# EAGLE board invaders (EAGLE 9.5.1)
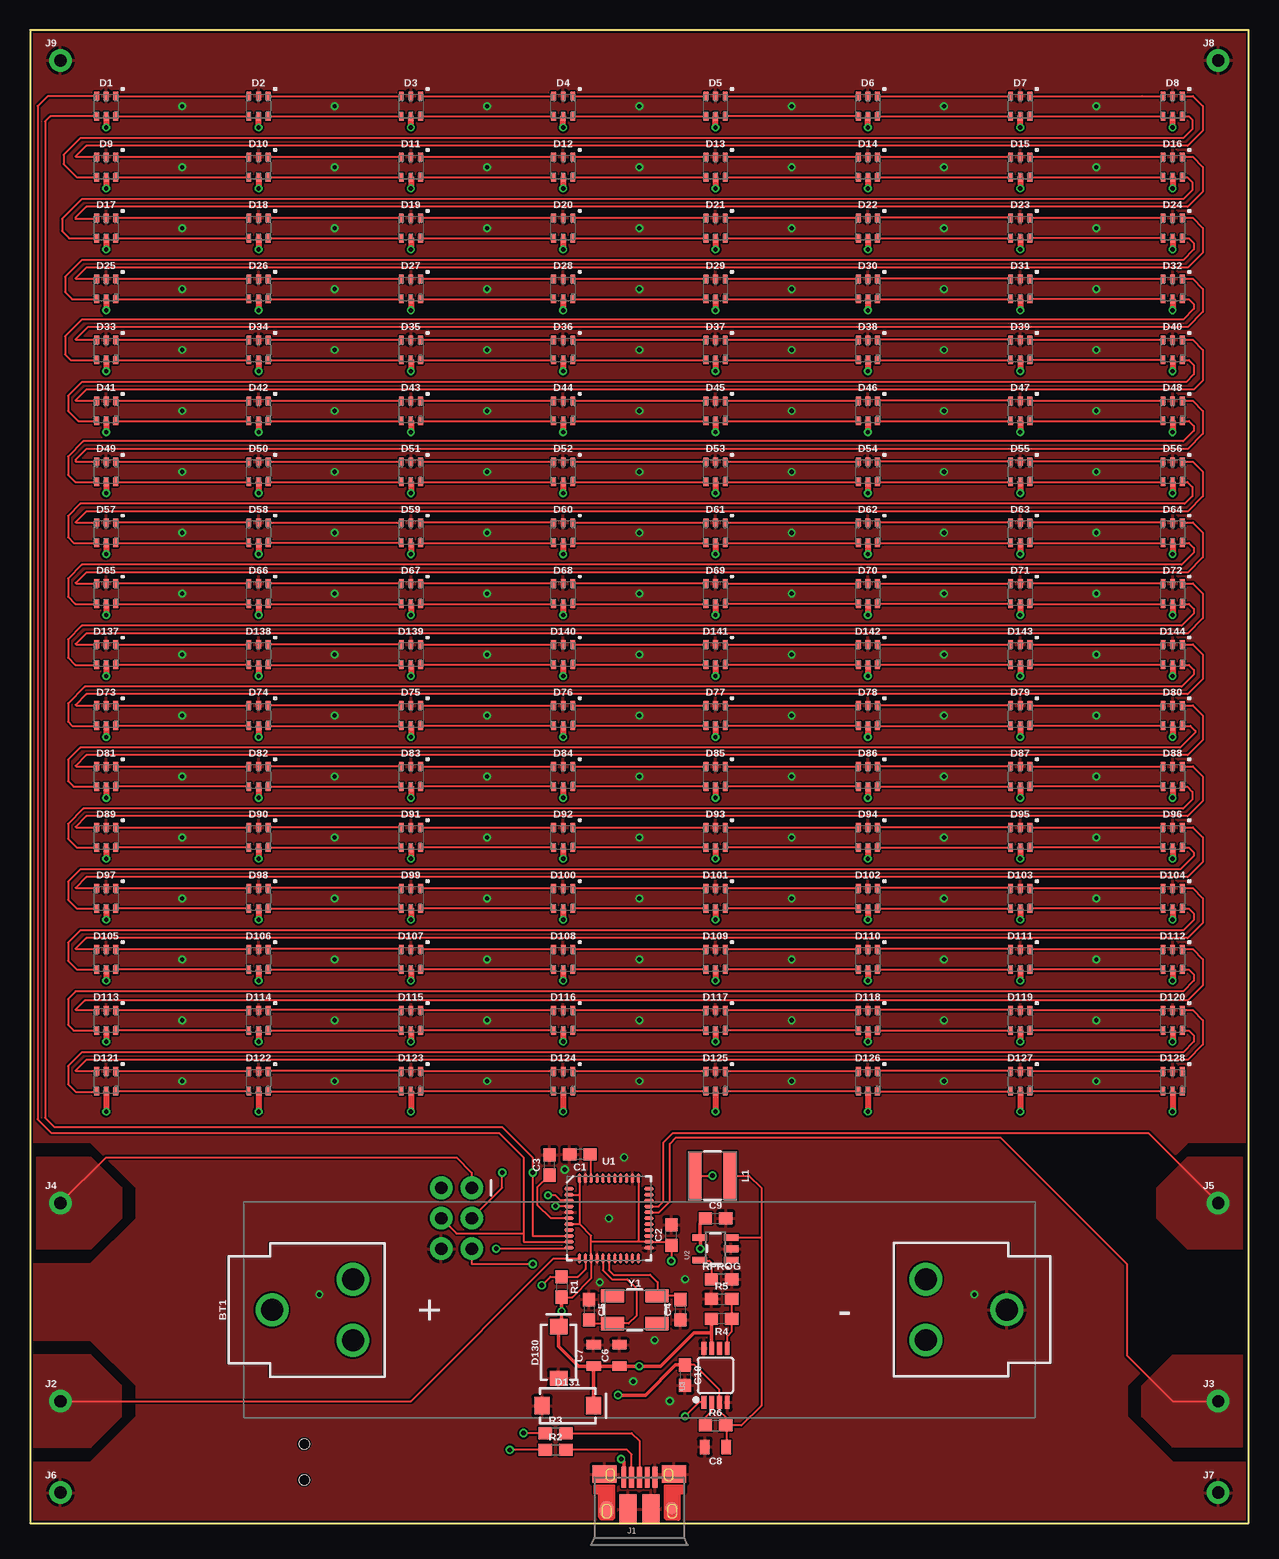
[diagram p2: board, top side]
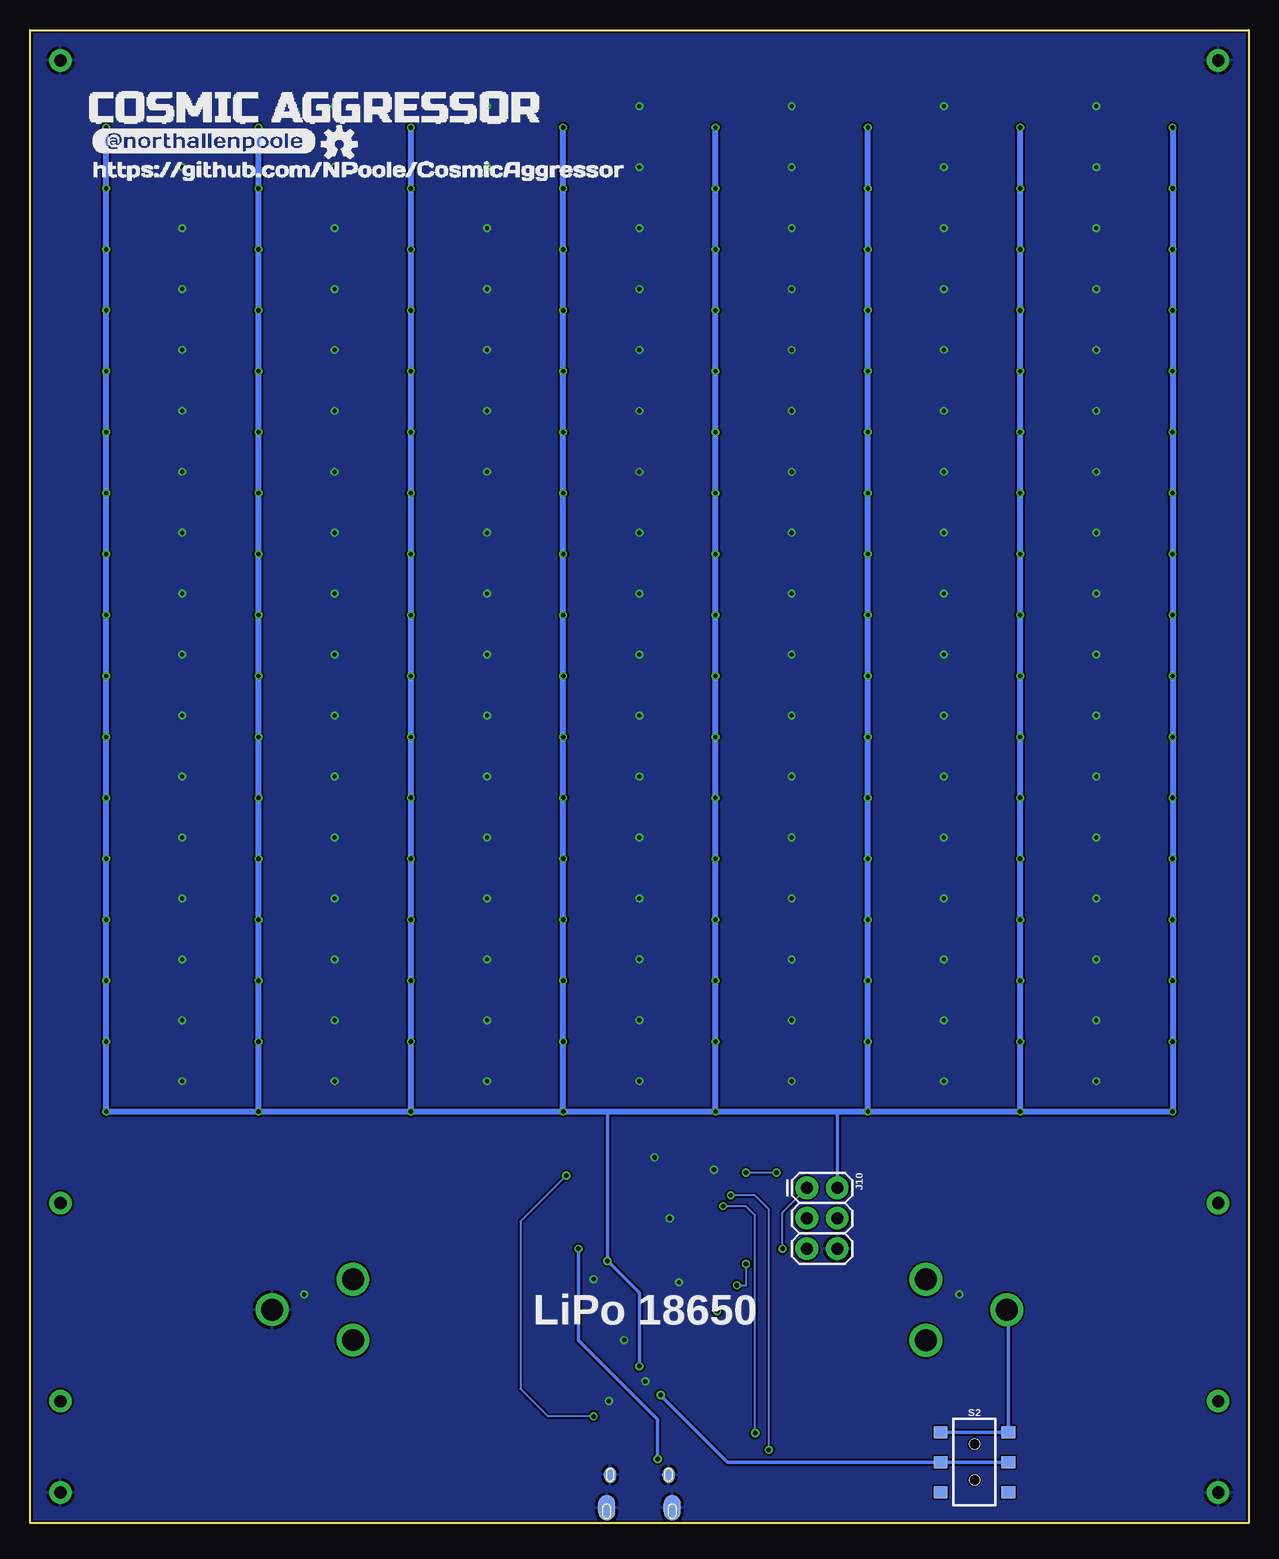
[diagram p3: board, bottom side, seen from below]

Size 101.6 x 124.46 mm. Coordinates in mm from the lower left corner, seen from the top.
Outline: 0,0 101.6,0 101.6,124.46 0,124.46 0,0
Copper layers (1*16): Top 0.035mm / dielectric 1.5mm / Bottom 0.035mm
Design rules "SparkFun-2-layer-PCBWay-LIMIT": minimum track width 6mil, minimum drill 0.3mm, track to track 6mil, track to pad 6mil, pad to pad 6mil, via to via 6mil, smd to smd 6mil, copper to edge 6mil, drill to drill 6mil, minimum pad ring 6mil, minimum via ring 6mil, stop-mask expansion 4mil, vias tented up to drill 25mil, thermal gap 10mil
Net classes: 0 default: width 0.152 mm, drill 0.305 mm, clearance 0.152 mm; 1 VCC: width 0.508 mm

## Footprints (pad centres in the part's own frame; a part is rotated, then mirrored left to right if it is on the bottom)
BATTERY_18650-HOLDER = drill 1.829: GND@1 30.628,0.01; GND@2 23.88,2.55; GND@3 23.88,-2.53; PWR@1 -30.628,-0.01; PWR@2 -23.88,2.53; PWR@3 -23.88,-2.55
0603 = smd 1.1 x 1: 1 -0.85,0; 2 0.85,0
0805 = smd 0.8 x 1.2: 1 -0.9,0; 2 0.9,0
APA102-2020 = smd 0.4 x 0.7: CKI -0.8,-0.85; CKO 0.8,-0.85; GND 0,0.85; SDI -0.8,0.85; SDO 0.8,0.85; VDD 0,-0.85
SMA-DIODE = smd 1.27 x 1.47: A -2.15,0; C 2.15,0
USB-MICROB-PTH-MILL = smd 0.4 x 1.75: D+ 0,0; D- -0.65,0; GND 1.3,0; ID 0.65,0; VBUS -1.3,0 | smd 2 x 1.46: SHIELD -2.9,0.275; SHIELD2 2.9,0.275 | smd 1.425 x 2.5: SHIELD3 -0.963,-2.675; SHIELD4 0.963,-2.675 | smd 1.4 x 2.1 bottom: SHIELD5 -2.731,-2.531; SHIELD7 2.729,-2.531 | smd 1 x 1: SHIELD6 2.7,-2.575 | smd 1.1 x 1.5: SHIELD8 -2.731,-2.731 | smd 1 x 1.3 bottom: SHIELD9 -2.43,0.195; SHIELD10 2.43,0.195
1X01NS_KIT = drill 1.016 pad 1.88: 1 0,0
2X3 = drill 1.016 pad 1.88: 1 0,0; 2 0,2.54; 3 2.54,0; 4 2.54,2.54; 5 5.08,0; 6 5.08,2.54
INDUCTOR_4X4MM = smd 4.089 x 1.143: P$1 0,1.473; P$2 0,-1.473
0603@1 = smd 1.1 x 1: 1 -0.85,0; 2 0.85,0
SWITCH_DPDT_SMD_AYZ0202 = smd 1 x 1.15: 1 -2.5,2.825; 2 0,2.825; 3 2.5,2.825; 4 -2.5,-2.825; 5 0,-2.825; 6 2.5,-2.825 | hole 0.85: 1.5,0; -1.5,0
QFN-44-NOPAD_1:1-LESS_PASTE = smd 0.8 x 0.3: 1 -3.337,2.458; 2 -3.337,1.958; 3 -3.337,1.479; 4 -3.337,0.979; 5 -3.337,0.5; 6 -3.337,0; 7 -3.337,-0.5; 8 -3.337,-0.979; 9 -3.337,-1.479; 10 -3.337,-1.958; 11 -3.337,-2.458; 23 3.337,-2.458; 24 3.337,-1.958; 25 3.337,-1.479; 26 3.337,-0.979; 27 3.337,-0.5; 28 3.337,0; 29 3.337,0.5; 30 3.337,0.979; 31 3.337,1.479; 32 3.337,1.958; 33 3.337,2.458 | smd 0.3 x 0.8: 12 -2.458,-3.337; 13 -1.958,-3.337; 14 -1.479,-3.337; 15 -0.979,-3.337; 16 -0.5,-3.337; 17 0,-3.337; 18 0.5,-3.337; 19 0.979,-3.337; 20 1.479,-3.337; 21 1.958,-3.337; 22 2.458,-3.337; 34 2.458,3.337; 35 1.958,3.337; 36 1.479,3.337; 37 0.979,3.337; 38 0.5,3.337; 39 0,3.337; 40 -0.5,3.337; 41 -0.979,3.337; 42 -1.479,3.337; 43 -1.958,3.337; 44 -2.458,3.337
SOT23-5 = smd 0.55 x 1.2: 1 -0.95,-1.3; 2 0,-1.3; 3 0.95,-1.3; 4 0.95,1.3; 5 -0.95,1.3
MSOP8 = smd 0.4 x 1.1: 1 -0.975,-2.25; 2 -0.325,-2.25; 3 0.325,-2.25; 4 0.975,-2.25; 5 0.975,2.25; 6 0.325,2.25; 7 -0.325,2.25; 8 -0.975,2.25
CRYSTAL-SMD-5X3.2-4PAD = smd 1.9 x 1.1: 1 -1.85,-1.15; 2 1.85,-1.15; 3 1.85,1.15; 4 -1.85,1.15

## Placement (x,y rotation side)
BT1  [BATTERY_18650-HOLDER]  50.8,17.78 0 top
C1  0.1uF  [0603]  45.85,30.73 180 top
C2  1.0uF  [0603]  53.47,24 90 top
C3  1.0uF  [0603]  43.31,29.84 90 top
C4  18pF  [0603]  54.23,17.78 90 top
C5  18pF  [0603]  46.61,17.78 270 top
C6  22uF  [0805]  49.15,13.97 90 top
C7  22uF  [0805]  46.99,13.97 90 top
C8  22uF  [0805]  57.15,6.35 180 top
C9  4.7uF  [0603]  57.15,25.4 0 top
C10  4.7uF  [0603]  54.61,12.32 270 top
D1  APA102-2020  [APA102-2020]  6.35,118.11 0 top
D2  APA102-2020  [APA102-2020]  19.05,118.11 0 top
D3  APA102-2020  [APA102-2020]  31.75,118.11 0 top
D4  APA102-2020  [APA102-2020]  44.45,118.11 0 top
D5  APA102-2020  [APA102-2020]  57.15,118.11 0 top
D6  APA102-2020  [APA102-2020]  69.85,118.11 0 top
D7  APA102-2020  [APA102-2020]  82.55,118.11 0 top
D8  APA102-2020  [APA102-2020]  95.25,118.11 0 top
D9  APA102-2020  [APA102-2020]  6.35,113.03 0 top
D10  APA102-2020  [APA102-2020]  19.05,113.03 0 top
D11  APA102-2020  [APA102-2020]  31.75,113.03 0 top
D12  APA102-2020  [APA102-2020]  44.45,113.03 0 top
D13  APA102-2020  [APA102-2020]  57.15,113.03 0 top
D14  APA102-2020  [APA102-2020]  69.85,113.03 0 top
D15  APA102-2020  [APA102-2020]  82.55,113.03 0 top
D16  APA102-2020  [APA102-2020]  95.25,113.03 0 top
D17  APA102-2020  [APA102-2020]  6.35,107.95 0 top
D18  APA102-2020  [APA102-2020]  19.05,107.95 0 top
D19  APA102-2020  [APA102-2020]  31.75,107.95 0 top
D20  APA102-2020  [APA102-2020]  44.45,107.95 0 top
D21  APA102-2020  [APA102-2020]  57.15,107.95 0 top
D22  APA102-2020  [APA102-2020]  69.85,107.95 0 top
D23  APA102-2020  [APA102-2020]  82.55,107.95 0 top
D24  APA102-2020  [APA102-2020]  95.25,107.95 0 top
D25  APA102-2020  [APA102-2020]  6.35,102.87 0 top
D26  APA102-2020  [APA102-2020]  19.05,102.87 0 top
D27  APA102-2020  [APA102-2020]  31.75,102.87 0 top
D28  APA102-2020  [APA102-2020]  44.45,102.87 0 top
D29  APA102-2020  [APA102-2020]  57.15,102.87 0 top
D30  APA102-2020  [APA102-2020]  69.85,102.87 0 top
D31  APA102-2020  [APA102-2020]  82.55,102.87 0 top
D32  APA102-2020  [APA102-2020]  95.25,102.87 0 top
D33  APA102-2020  [APA102-2020]  6.35,97.79 0 top
D34  APA102-2020  [APA102-2020]  19.05,97.79 0 top
D35  APA102-2020  [APA102-2020]  31.75,97.79 0 top
D36  APA102-2020  [APA102-2020]  44.45,97.79 0 top
D37  APA102-2020  [APA102-2020]  57.15,97.79 0 top
D38  APA102-2020  [APA102-2020]  69.85,97.79 0 top
D39  APA102-2020  [APA102-2020]  82.55,97.79 0 top
D40  APA102-2020  [APA102-2020]  95.25,97.79 0 top
D41  APA102-2020  [APA102-2020]  6.35,92.71 0 top
D42  APA102-2020  [APA102-2020]  19.05,92.71 0 top
D43  APA102-2020  [APA102-2020]  31.75,92.71 0 top
D44  APA102-2020  [APA102-2020]  44.45,92.71 0 top
D45  APA102-2020  [APA102-2020]  57.15,92.71 0 top
D46  APA102-2020  [APA102-2020]  69.85,92.71 0 top
D47  APA102-2020  [APA102-2020]  82.55,92.71 0 top
D48  APA102-2020  [APA102-2020]  95.25,92.71 0 top
D49  APA102-2020  [APA102-2020]  6.35,87.63 0 top
D50  APA102-2020  [APA102-2020]  19.05,87.63 0 top
D51  APA102-2020  [APA102-2020]  31.75,87.63 0 top
D52  APA102-2020  [APA102-2020]  44.45,87.63 0 top
D53  APA102-2020  [APA102-2020]  57.15,87.63 0 top
D54  APA102-2020  [APA102-2020]  69.85,87.63 0 top
D55  APA102-2020  [APA102-2020]  82.55,87.63 0 top
D56  APA102-2020  [APA102-2020]  95.25,87.63 0 top
D57  APA102-2020  [APA102-2020]  6.35,82.55 0 top
D58  APA102-2020  [APA102-2020]  19.05,82.55 0 top
D59  APA102-2020  [APA102-2020]  31.75,82.55 0 top
D60  APA102-2020  [APA102-2020]  44.45,82.55 0 top
D61  APA102-2020  [APA102-2020]  57.15,82.55 0 top
D62  APA102-2020  [APA102-2020]  69.85,82.55 0 top
D63  APA102-2020  [APA102-2020]  82.55,82.55 0 top
D64  APA102-2020  [APA102-2020]  95.25,82.55 0 top
D65  APA102-2020  [APA102-2020]  6.35,77.47 0 top
D66  APA102-2020  [APA102-2020]  19.05,77.47 0 top
D67  APA102-2020  [APA102-2020]  31.75,77.47 0 top
D68  APA102-2020  [APA102-2020]  44.45,77.47 0 top
D69  APA102-2020  [APA102-2020]  57.15,77.47 0 top
D70  APA102-2020  [APA102-2020]  69.85,77.47 0 top
D71  APA102-2020  [APA102-2020]  82.55,77.47 0 top
D72  APA102-2020  [APA102-2020]  95.25,77.47 0 top
D73  APA102-2020  [APA102-2020]  6.35,67.31 0 top
D74  APA102-2020  [APA102-2020]  19.05,67.31 0 top
D75  APA102-2020  [APA102-2020]  31.75,67.31 0 top
D76  APA102-2020  [APA102-2020]  44.45,67.31 0 top
D77  APA102-2020  [APA102-2020]  57.15,67.31 0 top
D78  APA102-2020  [APA102-2020]  69.85,67.31 0 top
D79  APA102-2020  [APA102-2020]  82.55,67.31 0 top
D80  APA102-2020  [APA102-2020]  95.25,67.31 0 top
D81  APA102-2020  [APA102-2020]  6.35,62.23 0 top
D82  APA102-2020  [APA102-2020]  19.05,62.23 0 top
D83  APA102-2020  [APA102-2020]  31.75,62.23 0 top
D84  APA102-2020  [APA102-2020]  44.45,62.23 0 top
D85  APA102-2020  [APA102-2020]  57.15,62.23 0 top
D86  APA102-2020  [APA102-2020]  69.85,62.23 0 top
D87  APA102-2020  [APA102-2020]  82.55,62.23 0 top
D88  APA102-2020  [APA102-2020]  95.25,62.23 0 top
D89  APA102-2020  [APA102-2020]  6.35,57.15 0 top
D90  APA102-2020  [APA102-2020]  19.05,57.15 0 top
D91  APA102-2020  [APA102-2020]  31.75,57.15 0 top
D92  APA102-2020  [APA102-2020]  44.45,57.15 0 top
D93  APA102-2020  [APA102-2020]  57.15,57.15 0 top
D94  APA102-2020  [APA102-2020]  69.85,57.15 0 top
D95  APA102-2020  [APA102-2020]  82.55,57.15 0 top
D96  APA102-2020  [APA102-2020]  95.25,57.15 0 top
D97  APA102-2020  [APA102-2020]  6.35,52.07 0 top
D98  APA102-2020  [APA102-2020]  19.05,52.07 0 top
D99  APA102-2020  [APA102-2020]  31.75,52.07 0 top
D100  APA102-2020  [APA102-2020]  44.45,52.07 0 top
D101  APA102-2020  [APA102-2020]  57.15,52.07 0 top
D102  APA102-2020  [APA102-2020]  69.85,52.07 0 top
D103  APA102-2020  [APA102-2020]  82.55,52.07 0 top
D104  APA102-2020  [APA102-2020]  95.25,52.07 0 top
D105  APA102-2020  [APA102-2020]  6.35,46.99 0 top
D106  APA102-2020  [APA102-2020]  19.05,46.99 0 top
D107  APA102-2020  [APA102-2020]  31.75,46.99 0 top
D108  APA102-2020  [APA102-2020]  44.45,46.99 0 top
D109  APA102-2020  [APA102-2020]  57.15,46.99 0 top
D110  APA102-2020  [APA102-2020]  69.85,46.99 0 top
D111  APA102-2020  [APA102-2020]  82.55,46.99 0 top
D112  APA102-2020  [APA102-2020]  95.25,46.99 0 top
D113  APA102-2020  [APA102-2020]  6.35,41.91 0 top
D114  APA102-2020  [APA102-2020]  19.05,41.91 0 top
D115  APA102-2020  [APA102-2020]  31.75,41.91 0 top
D116  APA102-2020  [APA102-2020]  44.45,41.91 0 top
D117  APA102-2020  [APA102-2020]  57.15,41.91 0 top
D118  APA102-2020  [APA102-2020]  69.85,41.91 0 top
D119  APA102-2020  [APA102-2020]  82.55,41.91 0 top
D120  APA102-2020  [APA102-2020]  95.25,41.91 0 top
D121  APA102-2020  [APA102-2020]  6.35,36.83 0 top
D122  APA102-2020  [APA102-2020]  19.05,36.83 0 top
D123  APA102-2020  [APA102-2020]  31.75,36.83 0 top
D124  APA102-2020  [APA102-2020]  44.45,36.83 0 top
D125  APA102-2020  [APA102-2020]  57.15,36.83 0 top
D126  APA102-2020  [APA102-2020]  69.85,36.83 0 top
D127  APA102-2020  [APA102-2020]  82.55,36.83 0 top
D128  APA102-2020  [APA102-2020]  95.25,36.83 0 top
D130  3A/40V/500mV  [SMA-DIODE]  44.07,14.22 90 top
D131  3A/40V/500mV  [SMA-DIODE]  44.83,9.78 0 top
D137  APA102-2020  [APA102-2020]  6.35,72.39 0 top
D138  APA102-2020  [APA102-2020]  19.05,72.39 0 top
D139  APA102-2020  [APA102-2020]  31.75,72.39 0 top
D140  APA102-2020  [APA102-2020]  44.45,72.39 0 top
D141  APA102-2020  [APA102-2020]  57.15,72.39 0 top
D142  APA102-2020  [APA102-2020]  69.85,72.39 0 top
D143  APA102-2020  [APA102-2020]  82.55,72.39 0 top
D144  APA102-2020  [APA102-2020]  95.25,72.39 0 top
J1  [USB-MICROB-PTH-MILL]  50.8,3.81 0 top
J2  [1X01NS_KIT]  2.54,10.16 0 top
J3  [1X01NS_KIT]  99.06,10.16 0 top
J4  [1X01NS_KIT]  2.54,26.67 0 top
J5  [1X01NS_KIT]  99.06,26.67 0 top
J6  [1X01NS_KIT]  2.54,2.54 0 top
J7  [1X01NS_KIT]  99.06,2.54 0 top
J8  [1X01NS_KIT]  99.06,121.92 0 top
J9  [1X01NS_KIT]  2.54,121.92 0 top
J10  AVR_SPI_PROG_3X2PTH  [2X3]  36.83,27.94 270 bottom
L1  2.2UH3A  [INDUCTOR_4X4MM]  56.9,28.96 270 top
R1  10k  [0603@1]  44.32,19.68 270 top
R2  22  [0603@1]  43.81,6.1 0 top
R3  22  [0603@1]  43.81,7.49 0 top
R4  750K  [0603]  57.66,17.02 180 top
R5  100k  [0603]  57.66,18.67 0 top
R6  750K  [0603]  57.15,8.13 0 top
RPROG  2.0k  [0603]  57.66,20.32 0 top
S2  [SWITCH_DPDT_SMD_AYZ0202]  22.86,5.08 270 bottom
U1  32U4  [QFN-44-NOPAD_1:1-LESS_PASTE]  48.26,25.4 0 top
U2  MCP73831  [SOT23-5]  57.15,22.86 90 top
U3  PAM2401  [MSOP8]  57.15,12.32 0 top
U$1  [COSMIC_AGGRESSOR0]  99.06,118.11 0 bottom
U$2  [#NORTHALLENPOOLE1]  96.52,115.19 0 bottom
U$3  [HTTPS###GITHUB#COM#NPOOLE#COSMICAGGRESSOR2]  97.54,112.78 0 bottom
U$4  [OSHW-LOGO-S]  75.82,114.94 0 bottom
Y1  16MHz  [CRYSTAL-SMD-5X3.2-4PAD]  50.42,17.78 0 top

## Tracks (layer width: path | path; a pad name or v marks a point on that pad's centre or on a via)
5VIN  (via drill 0.38)
  Top 0.305: J1.VBUS 49.5,5.11 v49.28,5.33 | C9.1 55.85,24.95 U2.4 55.88,23.78 v55.88,22.86
  Bottom 0.305: v55.88,22.86 55.88,15.24 49.28,8.64 v49.28,5.33
!RST  (via drill 0.38)
  Top 0.152: U1.13 46.3,21.16 45.68,20.54 R1.1 43.4,20.54 v42.67,19.81 | J10.5 36.83,21.59 v41.91,21.59
  Bottom 0.152: v42.67,19.81 41.91,19.81 v41.91,21.59
D+  (via drill 0.35, 0.38)
  Top 0.152: U1.4 43.85,26.38 v43.81,26.42 | R3.1 v41.15,7.49
  Bottom 0.152: v41.15,7.49 41.15,25.65 41.91,26.42 v43.81,26.42
D-  (via drill 0.35, 0.38)
  Top 0.152: U1.3 44.24,26.88 43.81,27.3 v43.18,27.3 | R2.1 v40.01,6.1
  Bottom 0.152: v40.01,6.1 40.01,26.16 41.15,27.3 v43.18,27.3
EN
  Top 0.152: R6.1 56.3,8.8 56.83,9.33 U3.2
FIRE1
  Top 0.152: J2.1 31.75,10.16 43.65,22.06 U1.12
  pour Top (no thermals): 0,6.35 5.08,6.35 7.62,8.89 7.62,11.43 5.08,13.97 0,13.97
FIRE2
  Top 0.152: U1.29 52.44,25.9 53.34,26.8 53.34,31.62 53.85,32.13 80.9,32.13 91.44,21.59 91.44,13.97 95.25,10.16 J3.1
  pour Top (isolate 0.406, no thermals): 101.6,6.35 95.25,6.35 92.71,8.89 92.71,11.43 95.25,13.97 101.6,13.97
GND  (via drill 0.35, 0.38)
  other vias: 47.5,20.07 12.7,118.11 25.4,118.11 38.1,118.11 50.8,118.11 63.5,118.11 76.2,118.11 88.9,118.11 12.7,113.03 25.4,113.03 38.1,113.03 50.8,113.03 63.5,113.03 76.2,113.03 88.9,113.03 12.7,107.95 25.4,107.95 38.1,107.95 50.8,107.95 63.5,107.95 76.2,107.95 88.9,107.95 12.7,102.87 25.4,102.87 38.1,102.87 50.8,102.87 63.5,102.87 76.2,102.87 88.9,102.87 12.7,97.79 25.4,97.79 38.1,97.79 50.8,97.79 63.5,97.79 76.2,97.79 88.9,97.79 12.7,92.71 25.4,92.71 38.1,92.71 50.8,92.71 63.5,92.71 76.2,92.71 88.9,92.71 12.7,87.63 25.4,87.63 38.1,87.63 50.8,87.63 63.5,87.63 76.2,87.63 88.9,87.63 12.7,82.55 25.4,82.55 38.1,82.55 50.8,82.55 63.5,82.55 76.2,82.55 88.9,82.55 12.7,77.47 25.4,77.47 38.1,77.47 50.8,77.47 63.5,77.47 76.2,77.47 88.9,77.47 12.7,72.39 25.4,72.39 38.1,72.39 50.8,72.39 63.5,72.39 76.2,72.39 88.9,72.39 12.7,67.31 25.4,67.31 38.1,67.31 50.8,67.31 63.5,67.31 76.2,67.31 88.9,67.31 12.7,62.23 25.4,62.23 38.1,62.23 50.8,62.23 63.5,62.23 76.2,62.23 88.9,62.23 12.7,57.15 25.4,57.15 38.1,57.15 50.8,57.15 63.5,57.15 76.2,57.15 88.9,57.15 12.7,52.07 25.4,52.07 38.1,52.07 50.8,52.07 63.5,52.07 76.2,52.07 88.9,52.07 12.7,46.99 25.4,46.99 38.1,46.99 50.8,46.99 63.5,46.99 76.2,46.99 88.9,46.99 12.7,41.91 25.4,41.91 38.1,41.91 50.8,41.91 63.5,41.91 76.2,41.91 88.9,41.91 12.7,36.83 25.4,36.83 38.1,36.83 50.8,36.83 63.5,36.83 76.2,36.83 88.9,36.83 24.13,19.05 78.74,19.05 44.58,29.46 49.53,30.48 48.26,25.4 54.61,20.32 52.07,15.24 50.29,11.81 53.34,10.16
  pour Bottom: 0,124.46 101.6,124.46 101.6,0 0,0
  pour Top: 0,0 0,5.08 5.08,5.08 8.89,8.89 8.89,11.43 5.08,15.24 0,15.24 0,21.59 5.08,21.59 8.89,25.4 8.89,27.94 5.08,31.75 0,31.75 0,124.46 101.6,124.46 101.6,31.75 96.52,31.75 92.71,27.94 92.71,25.4 96.52,21.59 101.6,21.59 101.6,15.24 95.25,15.24 91.44,11.43 91.44,8.89 95.25,5.08 101.6,5.08 101.6,0
LEFT  (via drill 0.38)
  Top 0.152: U1.11 44.84,22.86 v38.86,22.86 | J4.1 6.35,30.48 35.56,30.48 36.83,29.21 J10.1
  Bottom 0.152: v38.86,22.86 38.86,25.91 J10.1
  pour Top (isolate 0.406, no thermals): 0,30.48 5.08,30.48 7.62,27.94 7.62,25.4 5.08,22.86 0,22.86
N$1
  Top 0.152: D74.CKI D73.CKO
N$2
  Top 0.152: D73.SDO D74.SDI
N$3
  Top 0.152: D1.CKO D2.CKI
N$4
  Top 0.152: D1.SDO D2.SDI
N$5
  Top 0.152: D2.CKO D3.CKI
N$6
  Top 0.152: D2.SDO D3.SDI
N$7
  Top 0.152: D3.CKO D4.CKI
N$8
  Top 0.152: D3.SDO D4.SDI
N$9
  Top 0.152: D4.CKO D5.CKI
N$10
  Top 0.152: D4.SDO D5.SDI
N$11
  Top 0.152: D6.CKI D5.CKO
N$12
  Top 0.152: D5.SDO D6.SDI
N$13
  Top 0.152: D6.CKO D7.CKI
N$14
  Top 0.152: D6.SDO D7.SDI
N$15
  Top 0.152: D7.CKO D8.CKI
N$16
  Top 0.152: D7.SDO 92.71,118.96 D8.SDI
N$17
  Top 0.152: D74.CKO D75.CKI
N$18
  Top 0.152: D75.SDI D74.SDO
N$19
  Top 0.152: D76.CKI D75.CKO
N$20
  Top 0.152: D75.SDO D76.SDI
N$21
  Top 0.152: D9.CKO D10.CKI
N$22
  Top 0.152: D9.SDO D10.SDI
N$23
  Top 0.152: D10.CKO D11.CKI
N$24
  Top 0.152: D10.SDO D11.SDI
N$25
  Top 0.152: D11.CKO D12.CKI
N$26
  Top 0.152: D11.SDO D12.SDI
N$27
  Top 0.152: D12.CKO D13.CKI
N$28
  Top 0.152: D12.SDO D13.SDI
N$29
  Top 0.152: D13.CKO D14.CKI
N$30
  Top 0.152: D13.SDO D14.SDI
N$31
  Top 0.152: D14.CKO D15.CKI
N$32
  Top 0.152: D14.SDO D15.SDI
N$33
  Top 0.152: D15.CKO D16.CKI
N$34
  Top 0.152: D15.SDO D16.SDI
N$35
  Top 0.152: D77.CKI D76.CKO
N$36
  Top 0.152: D76.SDO D77.SDI
N$37
  Top 0.152: D78.CKI D77.CKO
N$38
  Top 0.152: D77.SDO D78.SDI
N$39
  Top 0.152: D17.CKO D18.CKI
N$40
  Top 0.152: D17.SDO D18.SDI
N$41
  Top 0.152: D18.CKO D19.CKI
N$42
  Top 0.152: D18.SDO D19.SDI
N$43
  Top 0.152: D19.CKO D20.CKI
N$44
  Top 0.152: D19.SDO D20.SDI
N$45
  Top 0.152: D20.CKO D21.CKI
N$46
  Top 0.152: D20.SDO D21.SDI
N$47
  Top 0.152: D21.CKO D22.CKI
N$48
  Top 0.152: D21.SDO D22.SDI
N$49
  Top 0.152: D22.CKO D23.CKI
N$50
  Top 0.152: D23.SDI D22.SDO
N$51
  Top 0.152: D24.CKI D23.CKO
N$52
  Top 0.152: D23.SDO D24.SDI
N$53
  Top 0.152: D78.CKO D79.CKI
N$54
  Top 0.152: D79.SDI D78.SDO
N$55
  Top 0.152: D80.CKI D79.CKO
N$56
  Top 0.152: D79.SDO D80.SDI
N$57
  Top 0.152: D25.CKO D26.CKI
N$58
  Top 0.152: D25.SDO D26.SDI
N$59
  Top 0.152: D26.CKO D27.CKI
N$60
  Top 0.152: D26.SDO D27.SDI
N$61
  Top 0.152: D27.CKO D28.CKI
N$62
  Top 0.152: D27.SDO D28.SDI
N$63
  Top 0.152: D28.CKO D29.CKI
N$64
  Top 0.152: D28.SDO D29.SDI
N$65
  Top 0.152: D29.CKO D30.CKI
N$66
  Top 0.152: D29.SDO D30.SDI
N$67
  Top 0.152: D30.CKO D31.CKI
N$68
  Top 0.152: D31.SDI D30.SDO
N$69
  Top 0.152: D32.CKI D31.CKO
N$70
  Top 0.152: D31.SDO D32.SDI
N$71
  Top 0.152: D40.CKI D39.CKO
N$72
  Top 0.152: D39.SDO D40.SDI
N$73
  Top 0.152: D39.SDI D38.SDO
N$74
  Top 0.152: D38.CKO D39.CKI
N$75
  Top 0.152: D37.SDO D38.SDI
N$76
  Top 0.152: D37.CKO D38.CKI
N$77
  Top 0.152: D36.SDO D37.SDI
N$78
  Top 0.152: D36.CKO D37.CKI
N$79
  Top 0.152: D35.SDO D36.SDI
N$80
  Top 0.152: D35.CKO D36.CKI
N$81
  Top 0.152: D34.SDO D35.SDI
N$82
  Top 0.152: D34.CKO D35.CKI
N$83
  Top 0.152: D33.CKO D34.CKI
N$84
  Top 0.152: D33.SDO D34.SDI
N$85
  Top 0.152: D82.CKI D81.CKO
N$86
  Top 0.152: D81.SDO D82.SDI
N$87
  Top 0.152: D82.CKO D83.CKI
N$88
  Top 0.152: D83.SDI D82.SDO
N$89
  Top 0.152: D84.CKI D83.CKO
N$90
  Top 0.152: D83.SDO D84.SDI
N$91
  Top 0.152: D85.CKI D84.CKO
N$92
  Top 0.152: D84.SDO D85.SDI
N$93
  Top 0.152: D86.CKI D85.CKO
N$94
  Top 0.152: D85.SDO D86.SDI
N$95
  Top 0.152: D41.CKO D42.CKI
N$96
  Top 0.152: D41.SDO D42.SDI
N$97
  Top 0.152: D42.CKO D43.CKI
N$98
  Top 0.152: D42.SDO D43.SDI
N$99
  Top 0.152: D43.CKO D44.CKI
N$100
  Top 0.152: D43.SDO D44.SDI
N$101
  Top 0.152: D44.CKO D45.CKI
N$102
  Top 0.152: D44.SDO D45.SDI
N$103
  Top 0.152: D45.SDO D46.SDI
N$104
  Top 0.152: D45.CKO D46.CKI
N$105
  Top 0.152: D46.CKO D47.CKI
N$106
  Top 0.152: D47.SDI D46.SDO
N$107
  Top 0.152: D47.CKO D48.CKI
N$108
  Top 0.152: D47.SDO D48.SDI
N$109
  Top 0.152: D86.CKO D87.CKI
N$110
  Top 0.152: D87.SDI D86.SDO
N$111
  Top 0.152: D56.SDI D55.SDO
N$112
  Top 0.152: D55.CKO D56.CKI
N$113
  Top 0.152: D54.CKO D55.CKI
N$114
  Top 0.152: D55.SDI D54.SDO
N$115
  Top 0.152: D53.SDO D54.SDI
N$116
  Top 0.152: D53.CKO D54.CKI
N$117
  Top 0.152: D52.SDO D53.SDI
N$118
  Top 0.152: D52.CKO D53.CKI
N$119
  Top 0.152: D51.SDO D52.SDI
N$120
  Top 0.152: D51.CKO D52.CKI
N$121
  Top 0.152: D50.CKO D51.CKI
N$122
  Top 0.152: D50.SDO D51.SDI
N$123
  Top 0.152: D49.SDO D50.SDI
N$124
  Top 0.152: D49.CKO D50.CKI
N$125
  Top 0.152: D88.CKI D87.CKO
N$126
  Top 0.152: D87.SDO D88.SDI
N$127
  Top 0.152: D90.CKI D89.CKO
N$128
  Top 0.152: D89.SDO D90.SDI
N$129
  Top 0.152: D57.CKO D58.CKI
N$130
  Top 0.152: D58.SDI D57.SDO
N$131
  Top 0.152: D58.SDO D59.SDI
N$132
  Top 0.152: D59.CKI D58.CKO
N$133
  Top 0.152: D59.CKO D60.CKI
N$134
  Top 0.152: D60.SDI D59.SDO
N$135
  Top 0.152: D60.CKO D61.CKI
N$136
  Top 0.152: D60.SDO D61.SDI
N$137
  Top 0.152: D61.CKO D62.CKI
N$138
  Top 0.152: D61.SDO D62.SDI
N$139
  Top 0.152: D63.SDI D62.SDO
N$140
  Top 0.152: D62.CKO D63.CKI
N$141
  Top 0.152: D63.CKO D64.CKI
N$142
  Top 0.152: D64.SDI D63.SDO
N$143
  Top 0.152: D90.CKO D91.CKI
N$144
  Top 0.152: D91.SDI D90.SDO
N$145
  Top 0.152: D92.CKI D91.CKO
N$146
  Top 0.152: D91.SDO D92.SDI
N$147
  Top 0.152: D65.CKO D66.CKI
N$148
  Top 0.152: D66.SDI D65.SDO
N$149
  Top 0.152: D66.CKO D67.CKI
N$150
  Top 0.152: D67.SDI D66.SDO
N$151
  Top 0.152: D67.CKO D68.CKI
N$152
  Top 0.152: D68.SDI D67.SDO
N$153
  Top 0.152: D68.CKO D69.CKI
N$154
  Top 0.152: D69.SDI D68.SDO
N$155
  Top 0.152: D70.CKI D69.CKO
N$156
  Top 0.152: D69.SDO D70.SDI
N$157
  Top 0.152: D71.CKI D70.CKO
N$158
  Top 0.152: D70.SDO D71.SDI
N$159
  Top 0.152: D71.CKO D72.CKI
N$160
  Top 0.152: D72.SDI D71.SDO
N$161
  Top 0.152: D138.CKI D137.CKO
N$162
  Top 0.152: D137.SDO D138.SDI
N$163
  Top 0.152: D93.CKI D92.CKO
N$164
  Top 0.152: D92.SDO D93.SDI
N$165
  Top 0.152: D94.CKI D93.CKO
N$166
  Top 0.152: D93.SDO D94.SDI
N$167
  Top 0.152: D94.CKO D95.CKI
N$168
  Top 0.152: D95.SDI D94.SDO
N$169
  Top 0.152: D96.CKI D95.CKO
N$170
  Top 0.152: D95.SDO D96.SDI
N$171
  Top 0.152: D98.CKI D97.CKO
N$172
  Top 0.152: D97.SDO D98.SDI
N$173
  Top 0.152: D98.CKO D99.CKI
N$174
  Top 0.152: D99.SDI D98.SDO
N$175
  Top 0.152: D100.CKI D99.CKO
N$176
  Top 0.152: D99.SDO D100.SDI
N$177
  Top 0.152: D101.CKI D100.CKO
N$178
  Top 0.152: D100.SDO D101.SDI
N$179
  Top 0.152: D102.CKI D101.CKO
N$180
  Top 0.152: D101.SDO D102.SDI
N$181
  Top 0.152: D102.CKO D103.CKI
N$182
  Top 0.152: D103.SDI D102.SDO
N$183
  Top 0.152: D104.CKI D103.CKO
N$184
  Top 0.152: D103.SDO D104.SDI
N$185
  Top 0.152: D112.CKI D111.CKO
N$186
  Top 0.152: D111.SDO D112.SDI
N$187
  Top 0.152: D111.SDI D110.SDO
N$188
  Top 0.152: D110.CKO D111.CKI
N$189
  Top 0.152: D109.SDO D110.SDI
N$190
  Top 0.152: D110.CKI D109.CKO
N$191
  Top 0.152: D108.SDO D109.SDI
N$192
  Top 0.152: D109.CKI D108.CKO
N$193
  Top 0.152: D107.SDO D108.SDI
N$194
  Top 0.152: D108.CKI D107.CKO
N$195
  Top 0.152: D107.SDI D106.SDO
N$196
  Top 0.152: D106.CKO D107.CKI
N$197
  Top 0.152: D106.CKI D105.CKO
N$198
  Top 0.152: D105.SDO D106.SDI
N$199
  Top 0.152: D114.CKI D113.CKO
N$200
  Top 0.152: D113.SDO D114.SDI
N$201
  Top 0.152: D114.CKO D115.CKI
N$202
  Top 0.152: D115.SDI D114.SDO
N$203
  Top 0.152: D116.CKI D115.CKO
N$204
  Top 0.152: D115.SDO D116.SDI
N$205
  Top 0.152: D117.CKI D116.CKO
N$206
  Top 0.152: D116.SDO D117.SDI
N$207
  Top 0.152: D117.SDO D118.SDI
N$208
  Top 0.152: D118.CKI D117.CKO
N$209
  Top 0.152: D118.CKO D119.CKI
N$210
  Top 0.152: D119.SDI D118.SDO
N$211
  Top 0.152: D120.CKI D119.CKO
N$212
  Top 0.152: D119.SDO D120.SDI
N$213
  Top 0.152: D127.SDO D128.SDI
N$214
  Top 0.152: D128.CKI D127.CKO
N$215
  Top 0.152: D126.CKO D127.CKI
N$216
  Top 0.152: D127.SDI D126.SDO
N$217
  Top 0.152: D125.SDO D126.SDI
N$218
  Top 0.152: D126.CKI D125.CKO
N$219
  Top 0.152: D124.SDO D125.SDI
N$220
  Top 0.152: D125.CKI D124.CKO
N$221
  Top 0.152: D123.SDO D124.SDI
N$222
  Top 0.152: D124.CKI D123.CKO
N$223
  Top 0.152: D122.CKO D123.CKI
N$224
  Top 0.152: D123.SDI D122.SDO
N$225
  Top 0.152: D121.SDO D122.SDI
N$226
  Top 0.152: D122.CKI D121.CKO
N$227
  Top 0.152: U1.42 46.78,30.65 C1.1
N$228
  Top 0.152: C4.2 53.93,18.93 52.32,18.93 | 52.32,18.93 Y1.3 | U1.17 48.26,21.08 48.64,20.7 51.69,20.7 52.32,20.07 52.32,18.93
N$230
  Top 0.152: C5.2 46.91,16.63 48.51,16.63 Y1.1 49.9,16.63 50.55,17.27 50.55,19.56 49.78,20.32 48.51,20.32 47.76,21.07 U1.16
N$231
  Top 0.152: U1.6 43.43,25.4 42.29,26.54 42.29,27.98 C3.1
N$232
  Top 0.152: U2.5 55.85,21.87 56.64,21.87 56.81,21.71 RPROG.1
N$234
  Top 0.152: J1.D+ 50.8,6.86 50.16,7.49 R3.2
N$235
  Top 0.152: J1.D- 50.15,5.73 49.78,6.1 R2.2
N$236
  Top 0.152: U3.5 58.12,15.58 58.51,15.96 R4.1 R5.2
N$237  (via drill 0.38)
  Top 0.152: L1.P$2 v56.9,28.96 | U3.1 55.79,10.07 v54.61,8.89
  Bottom 0.152: v54.61,8.89 58.42,8.89 60.71,11.18 60.71,25.15 v56.9,28.96
N$238
  Bottom 0.305: BT1.PWR@1 20.04,17.63 S2.1 S2.4
N$241
  Top 0.152: D138.CKO D139.CKI
N$242
  Top 0.152: D139.SDI D138.SDO
N$243
  Top 0.152: D140.CKI D139.CKO
N$244
  Top 0.152: D139.SDO D140.SDI
N$245
  Top 0.152: D141.CKI D140.CKO
N$246
  Top 0.152: D140.SDO D141.SDI
N$247
  Top 0.152: D142.CKI D141.CKO
N$248
  Top 0.152: D141.SDO D142.SDI
N$249
  Top 0.152: D143.CKI D142.CKO
N$250
  Top 0.152: D142.SDO D143.SDI
N$251
  Top 0.152: D144.CKI D143.CKO
N$252
  Top 0.152: D143.SDO D144.SDI
R1CK  (via drill 0.38)
  Top 0.152: D1.CKI 1.69,117.26 1.27,116.84 1.27,33.78 2.03,33.02 39.37,33.02 41.91,30.48 v41.91,29.21 41.91,23.92 U1.9 | J10.3 39.37,27.94 v39.37,29.21
  Bottom 0.152: v39.37,29.21 v41.91,29.21
R1DA
  Top 0.152: D1.SDI 1.49,118.96 0.64,118.11 0.64,33.66 1.78,32.51 39.12,32.51 41.15,30.48 41.15,24.13 | 41.15,24.13 41.15,23.44 U1.10 | J10.4 35.56,24.13 41.15,24.13
R2CK
  Top 0.152: D8.CKO 96.61,117.26 96.9,116.97 96.9,116.2 96.14,115.44 4.19,115.44 2.79,114.05 2.79,113.28 3.9,112.18 D9.CKI
R2DA
  Top 0.152: D8.SDO 96.94,118.96 97.79,118.11 97.79,116.08 96.52,114.81 4.7,114.81 3.81,113.92 3.85,113.88 D9.SDI
R3CK
  Top 0.152: D16.CKO 96.48,112.18 96.9,111.76 96.9,111.12 96.14,110.36 4.32,110.36 2.67,108.71 2.67,107.7 3.26,107.1 D17.CKI
R3DA
  Top 0.152: D16.SDO 96.94,113.88 97.79,113.03 97.79,111 96.52,109.73 4.7,109.73 3.81,108.84 3.81,108.71 5.46,108.71 D17.SDI
R4CK
  Top 0.152: D24.CKO 96.61,107.1 97.03,106.68 97.03,106.17 96.14,105.28 4.32,105.28 2.92,103.89 2.92,102.62 3.52,102.02 D25.CKI
R4DA
  Top 0.152: D24.SDO 96.94,108.8 97.79,107.95 97.79,105.92 96.52,104.65 4.7,104.65 3.81,103.76 3.85,103.72 D25.SDI
R5CK
  Top 0.152: D32.CKO 96.61,102.02 97.03,101.6 97.03,101.22 96.14,100.33 4.32,100.33 2.92,98.93 2.92,97.41 3.39,96.94 D33.CKI
R5DA
  Top 0.152: D32.SDO 96.94,103.72 97.79,102.87 97.79,100.97 96.52,99.69 4.83,99.69 3.81,98.68 3.85,98.64 D33.SDI
R6CK
  Top 0.152: D40.CKO 96.61,96.94 97.03,96.52 97.03,95.76 96.39,95.12 4.32,95.12 3.17,93.98 3.17,92.71 4.03,91.86 D41.CKI
R6DA
  Top 0.152: D40.SDO 96.94,98.64 97.79,97.79 97.79,95.25 97.03,94.49 4.7,94.49 3.81,93.6 3.85,93.56 D41.SDI
R7CK
  Top 0.152: D48.CKO 96.61,91.86 97.03,91.44 97.03,91.06 96.14,90.17 4.45,90.17 3.17,88.9 3.17,87.38 3.77,86.78 D49.CKI
R7DA
  Top 0.152: D48.SDO 96.94,93.56 97.79,92.71 97.79,90.81 96.52,89.53 4.7,89.53 3.81,88.65 3.81,88.52 3.85,88.48 D49.SDI
R8CK
  Top 0.152: D56.CKO 96.48,86.78 96.9,86.36 96.9,85.6 96.27,84.96 4.19,84.96 3.17,83.95 3.17,82.17 3.64,81.7 D57.CKI
R8DA
  Top 0.152: D56.SDO 96.94,88.48 97.79,87.63 97.79,85.6 96.52,84.33 4.7,84.33 3.81,83.44 3.85,83.4 D57.SDI
R9CK
  Top 0.152: D64.CKO 96.61,81.7 97.03,81.28 97.03,80.9 96.01,79.88 4.32,79.88 3.17,78.74 3.17,77.22 3.77,76.62 D65.CKI
R9DA
  Top 0.152: D64.SDO 96.94,83.4 97.79,82.55 97.79,80.52 96.52,79.25 4.7,79.25 3.81,78.36 3.85,78.32 D65.SDI
R10CK
  Top 0.152: D72.CKO 96.61,76.62 97.03,76.2 97.03,75.82 96.01,74.8 4.32,74.8 3.17,73.66 3.17,72.14 3.77,71.54 D137.CKI
R10DA
  Top 0.152: D72.SDO 96.94,78.32 97.79,77.47 97.79,75.44 96.52,74.17 4.7,74.17 3.81,73.28 3.85,73.24 D137.SDI
R11CK
  Top 0.152: D144.CKO 96.61,71.54 97.03,71.12 97.03,70.74 96.01,69.72 4.57,69.72 3.17,68.33 3.17,66.8 3.52,66.46 D73.CKI
R11DA
  Top 0.152: D144.SDO 96.94,73.24 97.79,72.39 97.79,70.36 96.52,69.09 4.7,69.09 3.81,68.2 3.85,68.16 D73.SDI
R12CK
  Top 0.152: D80.CKO 96.73,66.46 97.16,66.04 97.16,65.91 95.89,64.64 4.19,64.64 3.17,63.63 3.17,61.85 3.64,61.38 D81.CKI
R12DA
  Top 0.152: D80.SDO 96.94,68.16 97.79,67.31 97.79,65.28 96.52,64.01 4.7,64.01 3.81,63.12 3.85,63.08 D81.SDI
R13CK
  Top 0.152: D88.CKO 96.48,61.38 96.9,60.96 96.9,60.33 96.14,59.56 4.45,59.56 3.17,58.29 3.17,57.02 3.9,56.3 D89.CKI
R13DA
  Top 0.152: D88.SDO 96.94,63.08 97.79,62.23 97.79,60.2 96.52,58.93 4.7,58.93 3.81,58.04 3.85,58 D89.SDI
R14CK
  Top 0.152: D96.CKO 96.61,56.3 97.03,55.88 97.03,55.63 95.89,54.48 4.19,54.48 3.17,53.47 3.17,51.94 3.9,51.22 D97.CKI
R14DA
  Top 0.152: D96.SDO 96.94,58 97.79,57.15 97.79,55.12 96.52,53.85 4.7,53.85 3.81,52.96 3.85,52.92 D97.SDI
R15CK
  Top 0.152: D104.CKO 96.61,51.22 97.03,50.8 97.03,50.29 96.14,49.4 4.19,49.4 3.17,48.39 3.17,46.86 3.9,46.14 D105.CKI
R15DA
  Top 0.152: D104.SDO 96.94,52.92 97.79,52.07 97.79,50.04 96.52,48.77 4.7,48.77 3.81,47.88 3.85,47.84 D105.SDI
R16CK
  Top 0.152: D112.CKO 96.61,46.14 97.03,45.72 97.03,45.21 96.14,44.32 3.81,44.32 3.17,43.69 3.17,41.53 3.64,41.06 D113.CKI
R16DA
  Top 0.152: D112.SDO 96.94,47.84 97.79,46.99 97.79,44.83 96.52,43.56 4.57,43.56 3.81,42.8 3.85,42.76 D113.SDI
R17CK
  Top 0.152: D120.CKO 96.61,41.06 97.03,40.64 97.03,40.13 96.14,39.24 4.32,39.24 3.17,38.1 3.17,36.58 3.81,35.94 5.51,35.94 D121.CKI
R17DA
  Top 0.152: D120.SDO 96.94,42.76 97.79,41.91 97.79,39.88 96.52,38.61 4.7,38.61 3.81,37.72 3.85,37.68 D121.SDI
RIGHT
  Top 0.152: 98.77,26.38 J5.1 93.22,32.51 53.59,32.51 52.83,31.75 52.83,26.8 52.41,26.38 U1.30
  pour Top (isolate 0.406, no thermals): 101.6,22.86 96.52,22.86 93.98,25.4 93.98,27.94 96.52,30.48 101.6,30.48
VBATT  (via drill 0.38)
  Top 0.152: L1.P$1 59.94,28.96 60.96,27.94 60.96,23.81 | U2.3 60.96,23.81 | C10.1 55.41,13.17 57.48,11.11 U3.3 57.48,9.33 58,8.8 R6.2 | R6.2 58.05,8.08 C8.1 | 60.96,23.81 60.96,9.78 59.31,8.13 R6.2
  Top 0.305: C10.1 53.81,13.17 51.31,10.67 v49.02,10.67
  Bottom 0.305: v49.02,10.67 43.43,5.08 S2.5 S2.2
VCC  (via drill 0.35, 0.38)
  Top 0.152: 46.78,23.5 U1.14 46.78,20.4 45.21,18.84 R1.2 | 46.78,23.5 46.78,23.96 45.84,24.9 | 45.84,24.9 45.85,24.9 45.8,24.95 45.8,27.3 | 45.84,24.9 U1.7 | U1.44 45.8,27.3 | U1.2 45.75,27.36 45.8,27.3 | 50.8,23.44 U1.24 53.18,23.44 C2.1 v53.47,21.84 | 50.8,23.44 46.83,23.44 46.78,23.5 | U1.34 50.72,23.52 50.8,23.44
  Top 0.305: R1.2 v44.32,17.65 44.32,16.63 D130.C 44.07,14.73 45.73,13.07 C7.1 | C7.1 D131.C | C7.1 C6.1 v50.8,13.07 52.57,13.07 55.37,15.88 56.83,15.88 | U3.7 56.83,15.88 | 56.83,15.88 56.83,17 R4.2
  Top 0.508: D1.VDD v6.35,116.33 | v95.25,116.33 D8.VDD | D9.VDD v6.35,111.25 | D17.VDD v6.35,106.17 | D25.VDD v6.35,101.09 | D33.VDD v6.35,96.01 | D41.VDD v6.35,90.93 | D49.VDD v6.35,85.85 | D57.VDD v6.35,80.77 | D65.VDD v6.35,75.69 | D137.VDD v6.35,70.61 | D73.VDD v6.35,65.53 | D81.VDD v6.35,60.45 | D89.VDD v6.35,55.37 | D97.VDD v6.35,50.29 | D105.VDD v6.35,45.21 | D113.VDD v6.35,40.13 | D121.VDD v6.35,34.29 | v19.05,116.33 D2.VDD | v31.75,116.33 D3.VDD | v44.45,116.33 D4.VDD | v57.15,116.33 D5.VDD | v69.85,116.33 D6.VDD | v82.55,116.33 D7.VDD | D10.VDD v19.05,111.25 | D18.VDD v19.05,106.17 | D26.VDD v19.05,101.09 | D34.VDD v19.05,96.01 | D42.VDD v19.05,90.93 | D50.VDD v19.05,85.85 | D58.VDD v19.05,80.77 | D66.VDD v19.05,75.69 | D138.VDD v19.05,70.61 | D74.VDD v19.05,65.53 | D82.VDD v19.05,60.45 | D90.VDD v19.05,55.37 | D98.VDD v19.05,50.29 | D106.VDD v19.05,45.21 | D114.VDD v19.05,40.13 | D122.VDD v19.05,34.29 | D123.VDD v31.75,34.29 | D124.VDD v44.45,34.29 | D125.VDD v57.15,34.29 | D126.VDD v69.85,34.29 | D127.VDD v82.55,34.29 | D128.VDD v95.25,34.29 | D120.VDD v95.25,40.13 | D112.VDD v95.25,45.21 | D104.VDD v95.25,50.29 | D96.VDD v95.25,55.37 | D88.VDD v95.25,60.45 | D80.VDD v95.25,65.53 | D144.VDD v95.25,70.61 | D72.VDD v95.25,75.69 | D64.VDD v95.25,80.77 | D56.VDD v95.25,85.85 | D48.VDD v95.25,90.93 | D40.VDD v95.25,96.01 | D32.VDD v95.25,101.09 | D24.VDD v95.25,106.17 | D16.VDD v95.25,111.25 | D11.VDD v31.75,111.25 | D12.VDD v44.45,111.25 | D13.VDD v57.15,111.25 | D14.VDD v69.85,111.25 | D15.VDD v82.55,111.25 | D23.VDD v82.55,106.17 | D22.VDD v69.85,106.17 | D21.VDD v57.15,106.17 | D20.VDD v44.45,106.17 | D19.VDD v31.75,106.17 | D27.VDD v31.75,101.09 | D28.VDD v44.45,101.09 | D29.VDD v57.15,101.09
  Top 0.508: D30.VDD v69.85,101.09 | D31.VDD v82.55,101.09 | D39.VDD v82.55,96.01 | D47.VDD v82.55,90.93 | D38.VDD v69.85,96.01 | D46.VDD v69.85,90.93 | D45.VDD v57.15,90.93 | D37.VDD v57.15,96.01 | D36.VDD v44.45,96.01 | D44.VDD v44.45,90.93 | D52.VDD v44.45,85.85 | D53.VDD v57.15,85.85 | D54.VDD v69.85,85.85 | D55.VDD v82.55,85.85 | D35.VDD v31.75,96.01 | D43.VDD v31.75,90.93 | D51.VDD v31.75,85.85 | D59.VDD v31.75,80.77 | D60.VDD v44.45,80.77 | D61.VDD v57.15,80.77 | D62.VDD v69.85,80.77 | D63.VDD v82.55,80.77 | D71.VDD v82.55,75.69 | D143.VDD v82.55,70.61 | D79.VDD v82.55,65.53 | D87.VDD v82.55,60.45 | D95.VDD v82.55,55.37 | D94.VDD v69.85,55.37 | D86.VDD v69.85,60.45 | D78.VDD v69.85,65.53 | D142.VDD v69.85,70.61 | D70.VDD v69.85,75.69 | D69.VDD v57.15,75.69 | D68.VDD v44.45,75.69 | D67.VDD v31.75,75.69 | D139.VDD v31.75,70.61 | D75.VDD v31.75,65.53 | D83.VDD v31.75,60.45 | D91.VDD v31.75,55.37 | D92.VDD v44.45,55.37 | D93.VDD v57.15,55.37 | D85.VDD v57.15,60.45 | D84.VDD v44.45,60.45 | D76.VDD v44.45,65.53 | D77.VDD v57.15,65.53 | D141.VDD v57.15,70.61 | D140.VDD v44.45,70.61 | D102.VDD v69.85,50.29 | D103.VDD v82.55,50.29 | D111.VDD v82.55,45.21 | D119.VDD v82.55,40.13 | D118.VDD v69.85,40.13 | D110.VDD v69.85,45.21 | D109.VDD v57.15,45.21 | D101.VDD v57.15,50.29 | D117.VDD v57.15,40.13 | D108.VDD v44.45,45.21 | D116.VDD v44.45,40.13 | D100.VDD v44.45,50.29 | D99.VDD v31.75,50.29 | D107.VDD v31.75,45.21 | D115.VDD v31.75,40.13
  Bottom 0.305: 53.47,34.29 v53.47,21.84 50.8,19.18 v50.8,13.07 | J10.2 34.29,34.29
  Bottom 0.508: v6.35,116.33 v6.35,111.25 v6.35,106.17 v6.35,101.09 v6.35,96.01 v6.35,90.93 v6.35,85.85 v6.35,80.77 v6.35,75.69 v6.35,70.61 v6.35,65.53 v6.35,60.45 v6.35,55.37 v6.35,50.29 v6.35,45.21 v6.35,40.13 v6.35,34.29 v19.05,34.29 | v19.05,34.29 v31.75,34.29 | v31.75,34.29 34.29,34.29 v44.45,34.29 | v44.45,34.29 53.47,34.29 v57.15,34.29 | v57.15,34.29 v69.85,34.29 | v69.85,34.29 v82.55,34.29 | v82.55,34.29 v95.25,34.29 v95.25,40.13 v95.25,45.21 v95.25,50.29 v95.25,55.37 v95.25,60.45 v95.25,65.53 v95.25,70.61 v95.25,75.69 v95.25,80.77 v95.25,85.85 v95.25,90.93 v95.25,96.01 v95.25,101.09 v95.25,106.17 v95.25,111.25 v95.25,116.33 | v19.05,34.29 v19.05,40.13 v19.05,45.21 v19.05,50.29 v19.05,55.37 v19.05,60.45 v19.05,65.53 v19.05,70.61 v19.05,75.69 v19.05,80.77 v19.05,85.85 v19.05,90.93 v19.05,96.01 v19.05,101.09 v19.05,106.17 v19.05,111.25 v19.05,116.33 | v31.75,34.29 v31.75,40.13 v31.75,45.21 v31.75,50.29 v31.75,55.37 v31.75,60.45 v31.75,65.53 v31.75,70.61 v31.75,75.69 v31.75,80.77 v31.75,85.85 v31.75,90.93 v31.75,96.01 v31.75,101.09 v31.75,106.17 v31.75,111.25 v31.75,116.33 | v44.45,34.29 v44.45,40.13 v44.45,45.21 v44.45,50.29 v44.45,55.37 v44.45,60.45 v44.45,65.53 v44.45,70.61 v44.45,75.69 v44.45,80.77 v44.45,85.85 v44.45,90.93 v44.45,96.01 v44.45,101.09 v44.45,106.17 v44.45,111.25 v44.45,116.33 | v57.15,34.29 v57.15,40.13 v57.15,45.21 v57.15,50.29 v57.15,55.37 v57.15,60.45 v57.15,65.53 v57.15,70.61 v57.15,75.69 v57.15,80.77 v57.15,85.85 v57.15,90.93 v57.15,96.01 v57.15,101.09 v57.15,106.17 v57.15,111.25 v57.15,116.33
  Bottom 0.508: v69.85,34.29 v69.85,40.13 v69.85,45.21 v69.85,50.29 v69.85,55.37 v69.85,60.45 v69.85,65.53 v69.85,70.61 v69.85,75.69 v69.85,80.77 v69.85,85.85 v69.85,90.93 v69.85,96.01 v69.85,101.09 v69.85,106.17 v69.85,111.25 v69.85,116.33 | v82.55,34.29 v82.55,40.13 v82.55,45.21 v82.55,50.29 v82.55,55.37 v82.55,60.45 v82.55,65.53 v82.55,70.61 v82.55,75.69 v82.55,80.77 v82.55,85.85 v82.55,90.93 v82.55,96.01 v82.55,101.09 v82.55,106.17 v82.55,111.25 v82.55,116.33

## Text on the board
bPlace: LiPo 18650